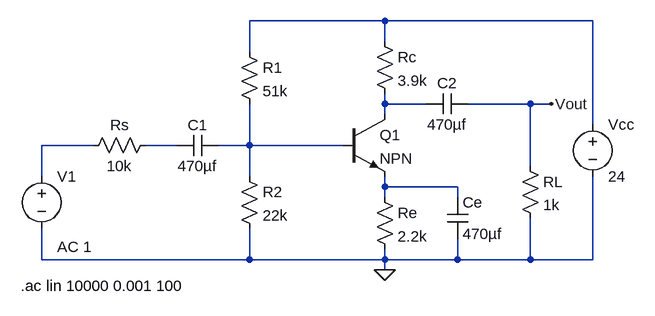
[diagram p0: schematic simulacion de resp en frec de amp.asc]
simulacion de resp en frec de amp.asc, the LTspice schematic file:
Version 4
SHEET 1 880 680
WIRE 496 32 288 32
WIRE 816 32 496 32
WIRE 496 64 496 32
WIRE 288 80 288 32
WIRE 496 160 496 144
WIRE 560 160 496 160
WIRE 720 160 624 160
WIRE 752 160 720 160
WIRE 496 176 496 160
WIRE 816 192 816 32
WIRE 48 224 -32 224
WIRE 176 224 128 224
WIRE 288 224 288 160
WIRE 288 224 240 224
WIRE 432 224 288 224
WIRE 720 256 720 160
WIRE -32 272 -32 224
WIRE 288 272 288 224
WIRE 496 288 496 272
WIRE 608 288 496 288
WIRE 496 304 496 288
WIRE 608 304 608 288
WIRE -32 400 -32 352
WIRE 288 400 288 352
WIRE 288 400 -32 400
WIRE 496 400 496 384
WIRE 496 400 288 400
WIRE 608 400 608 368
WIRE 608 400 496 400
WIRE 720 400 720 336
WIRE 720 400 608 400
WIRE 816 400 816 272
WIRE 816 400 720 400
WIRE 496 416 496 400
FLAG 496 416 0
FLAG 752 160 Vout
SYMBOL voltage -32 256 R0
WINDOW 123 24 124 Left 2
WINDOW 39 0 0 Left 0
SYMATTR Value2 AC 1
SYMATTR InstName V1
SYMATTR Value ""
SYMBOL voltage 816 176 R0
SYMATTR InstName Vcc
SYMATTR Value 24
SYMBOL res 144 208 R90
WINDOW 0 0 56 VBottom 2
WINDOW 3 32 56 VTop 2
SYMATTR InstName Rs
SYMATTR Value 10k
SYMBOL cap 240 208 R90
WINDOW 0 0 32 VBottom 2
WINDOW 3 32 32 VTop 2
SYMATTR InstName C1
SYMATTR Value 470µf
SYMBOL res 272 64 R0
SYMATTR InstName R1
SYMATTR Value 51k
SYMBOL res 272 256 R0
SYMATTR InstName R2
SYMATTR Value 22k
SYMBOL res 480 48 R0
SYMATTR InstName Rc
SYMATTR Value 3.9k
SYMBOL res 480 288 R0
SYMATTR InstName Re
SYMATTR Value 2.2k
SYMBOL npn 432 176 R0
SYMATTR InstName Q1
SYMBOL cap 592 304 R0
SYMATTR InstName Ce
SYMATTR Value 470µf
SYMBOL cap 624 144 R90
WINDOW 0 0 32 VBottom 2
WINDOW 3 32 32 VTop 2
SYMATTR InstName C2
SYMATTR Value 470µf
SYMBOL res 704 240 R0
SYMATTR InstName RL
SYMATTR Value 1k
TEXT -64 440 Left 2 !.ac lin 10000 0.001 100

The netlist it stands for:
* simulacion de resp en frec de amp.asc
V1 N003 0 AC 1
Vcc N001 0 24
Rs N004 N003 10k
C1 N005 N004 470µf
R1 N001 N005 51k
R2 N005 0 22k
Rc N001 N002 3.9k
Re N006 0 2.2k
Q1 N002 N005 N006 0 NPN
Ce N006 0 470µf
C2 Vout N002 470µf
RL Vout 0 1k
.model NPN NPN
.model PNP PNP
.lib standard.bjt
.ac lin 10000 0.001 100
.backanno
.end